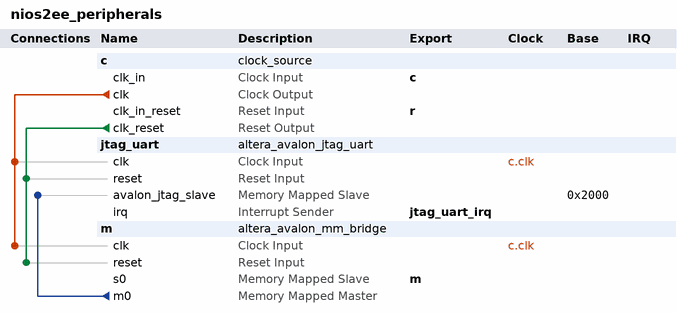
[diagram p0: system contents]
# Platform Designer (Qsys) system nios2ee_peripherals, Cyclone 10 LP 10CL006YE144C8G
# Parameters at their usual value, and those the tool derives, are not listed.
package require -exact qsys 17.1
create_system nios2ee_peripherals
set_project_property DEVICE_FAMILY {Cyclone 10 LP}
set_project_property DEVICE 10CL006YE144C8G

add_instance c clock_source 17.1
set_instance_parameter_value c clockFrequency 125000000

add_instance jtag_uart altera_avalon_jtag_uart 17.1
set_instance_parameter_value jtag_uart readBufferDepth 8
set_instance_parameter_value jtag_uart readIRQThreshold 4
set_instance_parameter_value jtag_uart simInteractiveOptions NO_INTERACTIVE_WINDOWS
set_instance_parameter_value jtag_uart useRegistersForReadBuffer true
set_instance_parameter_value jtag_uart useRegistersForWriteBuffer true
set_instance_parameter_value jtag_uart writeBufferDepth 8
set_instance_parameter_value jtag_uart writeIRQThreshold 4

add_instance m altera_avalon_mm_bridge 17.1
set_instance_parameter_value m ADDRESS_UNITS SYMBOLS
set_instance_parameter_value m ADDRESS_WIDTH 10
set_instance_parameter_value m DATA_WIDTH 32
set_instance_parameter_value m MAX_PENDING_RESPONSES 1
set_instance_parameter_value m PIPELINE_COMMAND 0
set_instance_parameter_value m PIPELINE_RESPONSE 0
set_instance_parameter_value m USE_AUTO_ADDRESS_WIDTH 1

# connections
add_connection c.clk jtag_uart.clk clock
add_connection c.clk m.clk clock
add_connection c.clk_reset jtag_uart.reset reset
add_connection c.clk_reset m.reset reset
add_connection m.m0 jtag_uart.avalon_jtag_slave avalon
set_connection_parameter_value m.m0/jtag_uart.avalon_jtag_slave baseAddress 0x2000

# exported interfaces
add_interface c clock sink
set_interface_property c EXPORT_OF c.clk_in
add_interface jtag_uart_irq interrupt sender
set_interface_property jtag_uart_irq EXPORT_OF jtag_uart.irq
add_interface m avalon slave
set_interface_property m EXPORT_OF m.s0
add_interface r reset sink
set_interface_property r EXPORT_OF c.clk_in_reset

set_interconnect_requirement {$system} qsys_mm.clockCrossingAdapter HANDSHAKE
set_interconnect_requirement {$system} qsys_mm.enableEccProtection FALSE
set_interconnect_requirement {$system} qsys_mm.insertDefaultSlave FALSE
set_interconnect_requirement {$system} qsys_mm.maxAdditionalLatency 1

save_system nios2ee_peripherals.qsys
